# EAGLE design coil-driver-2 (EAGLE 4.16)
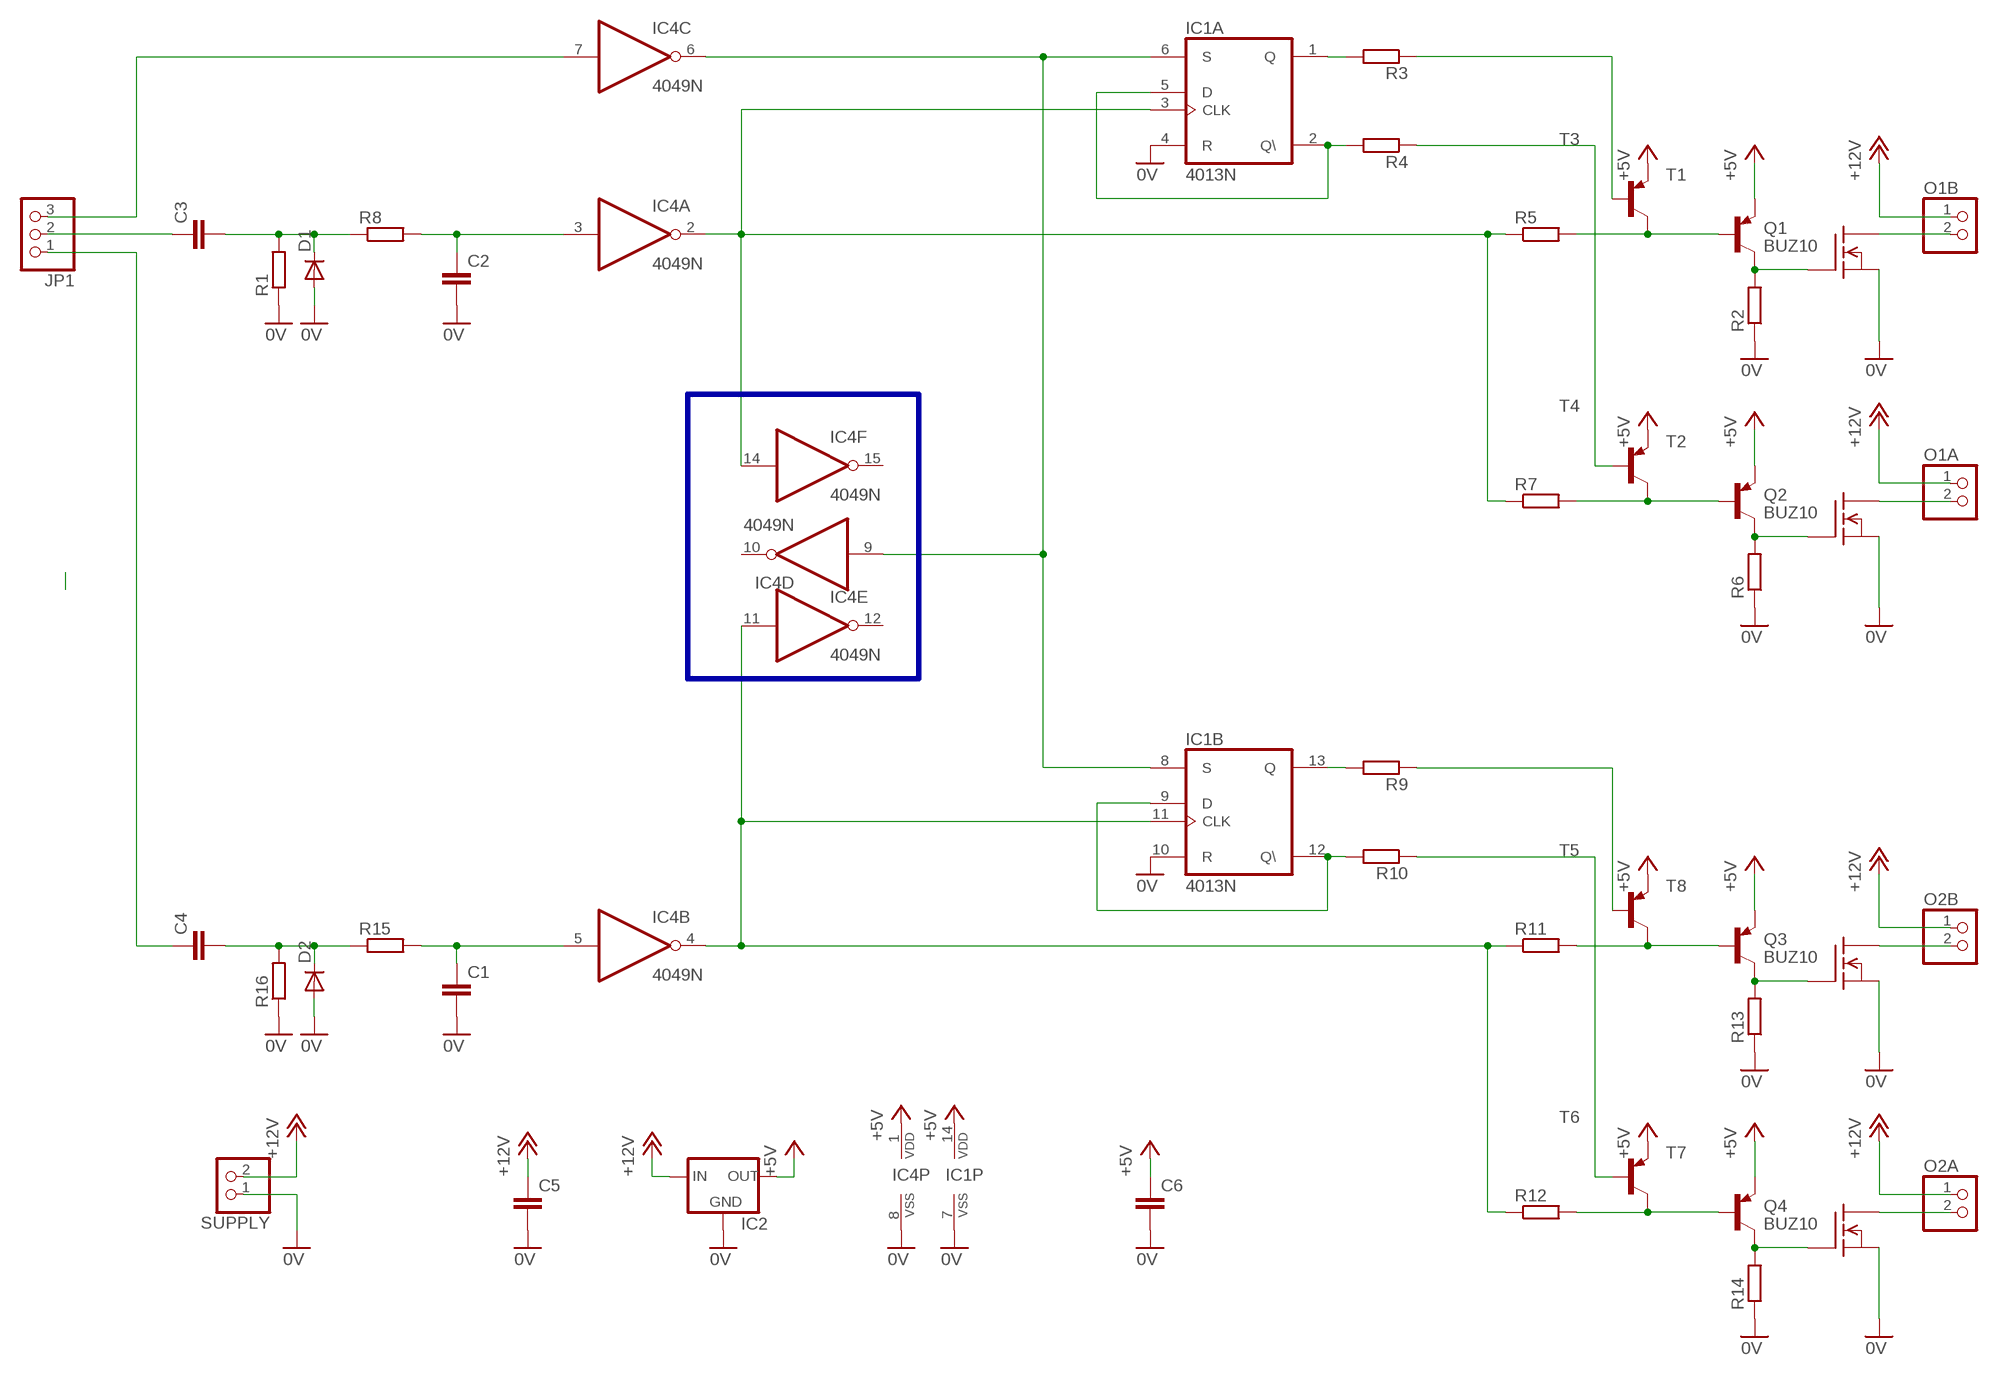
[diagram p0: schematic, sheet 1]

## Parts
C1  C-EU050-030X075  [C050-030X075]
C2  C-EU050-030X075  [C050-030X075]
C3  C-EU050-030X075  [C050-030X075]
C4  C-EU050-030X075  [C050-030X075]
C5  C-EU050-030X075  [C050-030X075]
C6  C-EU050-030X075  [C050-030X075]
D1  DIODE-D-7.5  [D-7.5]
D2  DIODE-D-7.5  [D-7.5]
IC1  4013N  [DIL14]
IC2  78XXL  [78XXL]
IC4  4049N  [DIL16]
JP1  PINHD-1X3  [1X03]
O1A  PINHD-1X2  [1X02]
O1B  PINHD-1X2  [1X02]
O2A  PINHD-1X2  [1X02]
O2B  PINHD-1X2  [1X02]
Q1  BUZ10  [TO220]
Q2  BUZ10  [TO220]
Q3  BUZ10  [TO220]
Q4  BUZ10  [TO220]
R1  R-EU_0207/7  [0207/7]
R2  R-EU_0207/7  [0207/7]
R3  R-EU_0207/7  [0207/7]
R4  R-EU_0207/7  [0207/7]
R5  R-EU_0207/7  [0207/7]
R6  R-EU_0207/7  [0207/7]
R7  R-EU_0207/7  [0207/7]
R8  R-EU_0207/7  [0207/7]
R9  R-EU_0207/7  [0207/7]
R10  R-EU_0207/7  [0207/7]
R11  R-EU_0207/7  [0207/7]
R12  R-EU_0207/7  [0207/7]
R13  R-EU_0207/7  [0207/7]
R14  R-EU_0207/7  [0207/7]
R15  R-EU_0207/7  [0207/7]
R16  R-EU_0207/7  [0207/7]
SUPPLY  PINHD-1X2  [1X02]
T1  BC557B-PNP-TO92-EBC  [TO92-EBC]
T2  BC557B-PNP-TO92-EBC  [TO92-EBC]
T3  BC557B-PNP-TO92-EBC  [TO92-EBC]
T4  BC557B-PNP-TO92-EBC  [TO92-EBC]
T5  BC557B-PNP-TO92-EBC  [TO92-EBC]
T6  BC557B-PNP-TO92-EBC  [TO92-EBC]
T7  BC557B-PNP-TO92-EBC  [TO92-EBC]
T8  BC557B-PNP-TO92-EBC  [TO92-EBC]

## Nets
0V: C1.2 C2.2 C5.2 C6.2 D1.A D2.A IC1.4(A:R) IC1.7(P:VSS) IC1.10(B:R) IC2.GND IC4.8(P:VSS) Q1.3(S) Q2.3(S) Q3.3(S) Q4.3(S) R1.1 R2.1 R6.1 R13.1 R14.1 R16.1 SUPPLY.1
+5V: C6.1 IC1.14(P:VDD) IC2.OUT IC4.1(P:VDD) T1.E T2.E T3.E T4.E T5.E T6.E T7.E T8.E
+12V: C5.1 IC2.IN O1A.1 O1B.1 O2A.1 O2B.1 SUPPLY.2
N$1: Q1.1(G) R2.2 T1.C
N$2: O1B.2 Q1.2(D)
N$3: IC1.1(A:Q) R3.2
N$4: IC1.2(A:Q\) IC1.5(A:D) R4.2
N$5: R3.1 T3.B
N$6: IC1.3(A:CLK) IC4.2(A:O) IC4.14(F:I) R5.1 R7.1
N$7: O1A.2 Q2.2(D)
N$8: C2.1 IC4.3(A:I) R8.2
N$9: Q2.1(G) R6.2 T2.C
N$10: R4.1 T4.B
N$11: R5.2 T1.B T3.C
N$12: IC1.11(B:CLK) IC4.4(B:O) IC4.11(E:I) R11.1 R12.1
N$13: IC1.13(B:Q) R9.2
N$14: R7.2 T2.B T4.C
N$15: C3.2 D1.C R1.2 R8.1
N$16: IC1.9(B:D) IC1.12(B:Q\) R10.2
N$17: R9.1 T5.B
N$18: R10.1 T6.B
N$19: Q3.1(G) R13.2 T8.C
N$20: R11.2 T5.C T8.B
N$21: R12.2 T6.C T7.B
N$22: Q4.1(G) R14.2 T7.C
N$23: O2A.2 Q4.2(D)
N$24: O2B.2 Q3.2(D)
N$25: C4.2 D2.C R15.1 R16.2
N$26: C1.1 IC4.5(B:I) R15.2
N$27: C4.1 JP1.1
N$28: C3.1 JP1.2
N$29: IC1.6(A:S) IC1.8(B:S) IC4.6(C:O) IC4.9(D:I)
N$32: IC4.7(C:I) JP1.3
Unconnected: IC4.10(D:O) IC4.12(E:O) IC4.15(F:O)

## Buses
B$1

## Library data of the parts
C1-C6 = rcl:C-EU: CAPACITOR, European symbol
D1 D2 = diode:DIODE-: DIODE
IC1 = 40xx:4013: Dual D FLIP FLOP, set/reset
IC2 = v-reg:78XXL: VOLTAGE REGULATOR
IC4 = 40xx:4049: Hex inverting BUFFER
JP1 = pinhead:PINHD-1X3: PIN HEADER
O1A O1B O2A O2B SUPPLY = pinhead:PINHD-1X2: PIN HEADER
Q1-Q4 = transistor-fet:BUZ10: N-Channel Enhancement MOSFET 50V; 20A; 0,080Ohm
R1-R16 = rcl:R-EU_: RESISTOR, European symbol
T1-T8 = transistor:*-PNP-: PNP Transistror

## Board
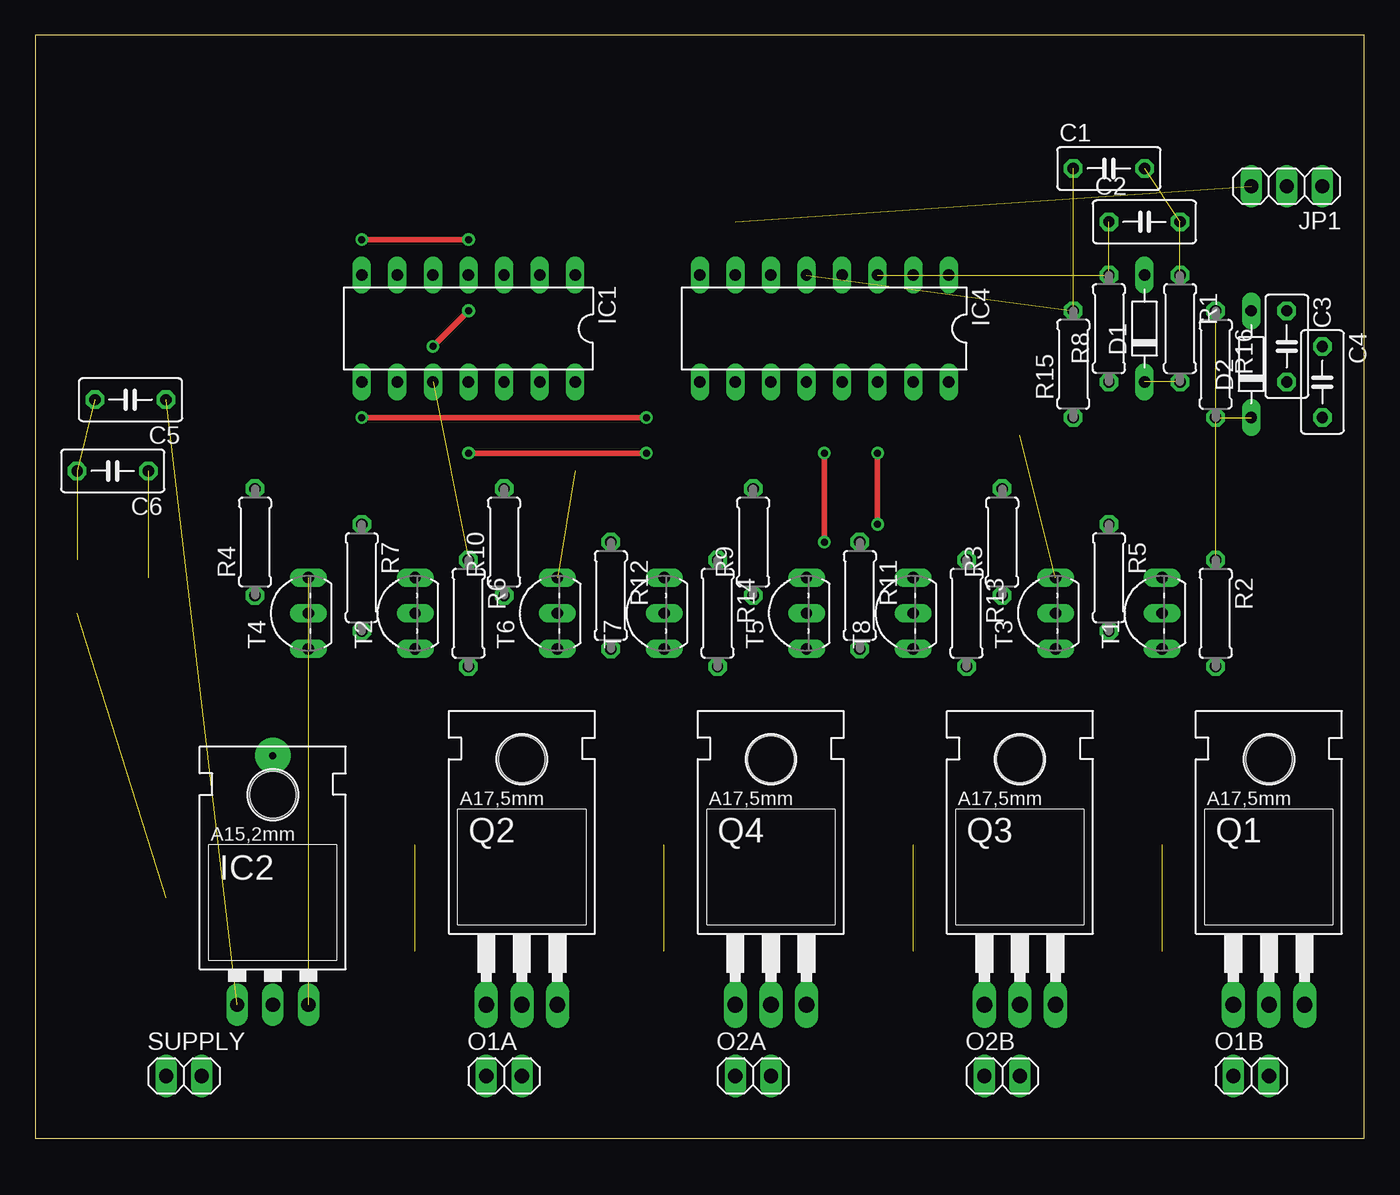
[diagram p1: board, top side]
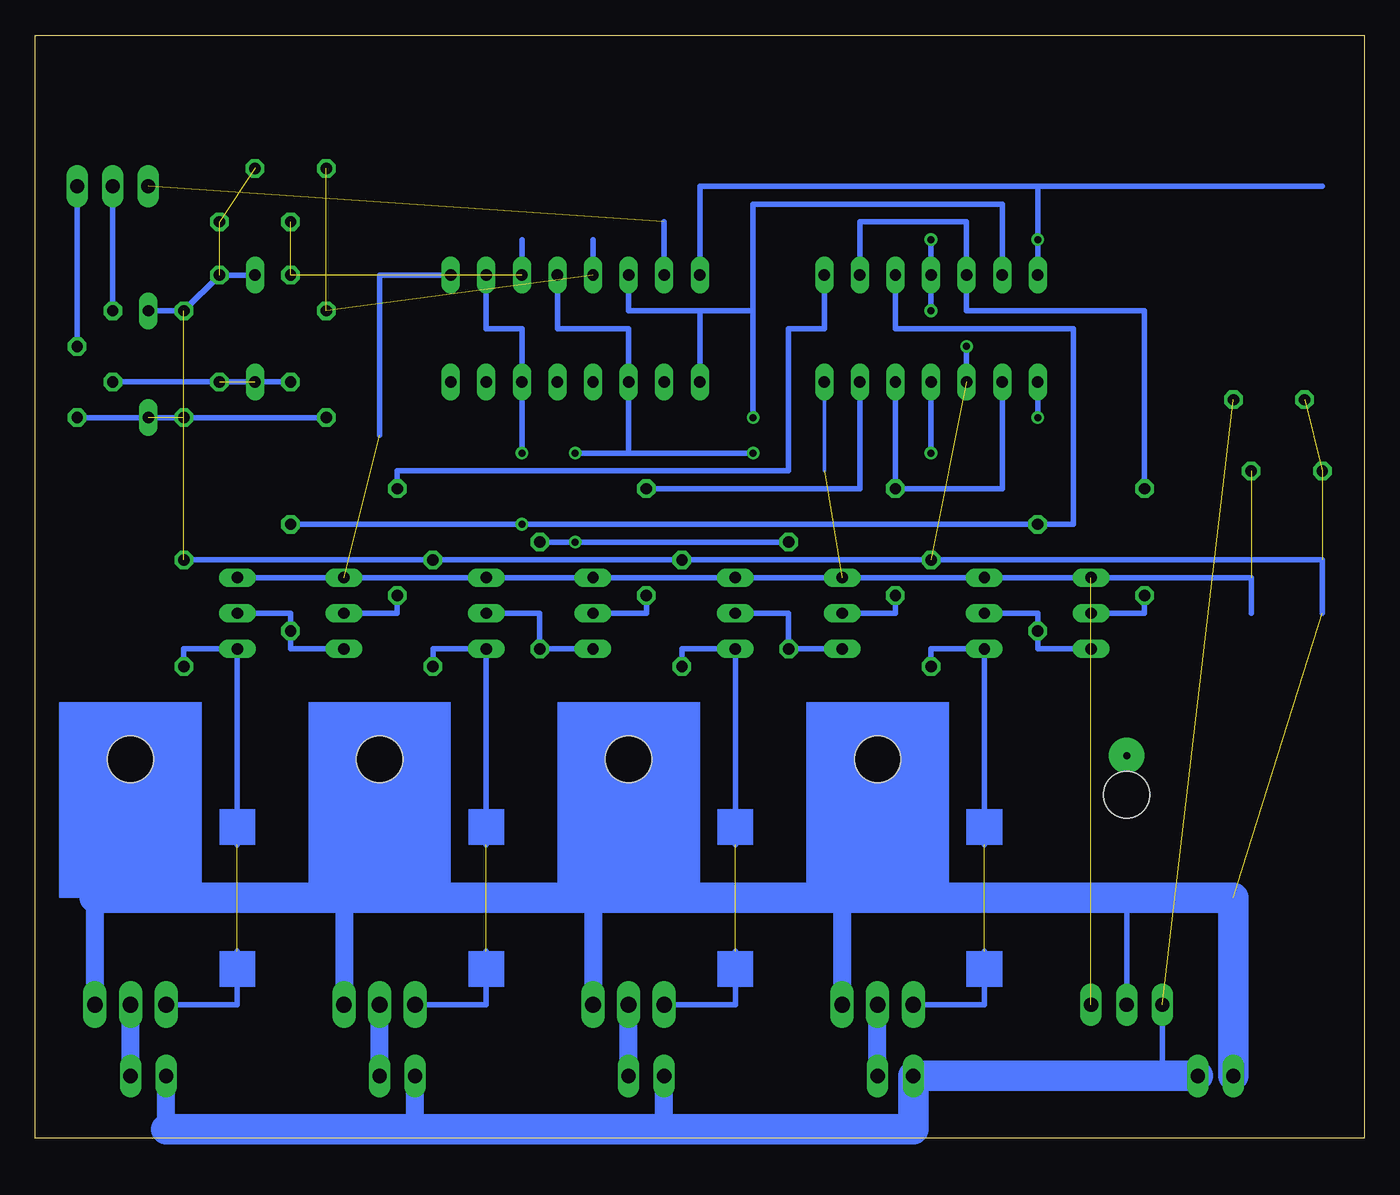
[diagram p2: board, bottom side, seen from below]

Size 94.92 x 78.73 mm. Coordinates in mm from the lower left corner, seen from the top.
Outline: 0,0 94.92,0 94.92,78.73 0,78.73 0,0
Copper layers (1*16): Top 0.035mm / dielectric 1.5mm / Bottom 0.035mm
Design rules "default": minimum track width 10mil, minimum drill 24mil, track to track 8mil, track to pad 8mil, pad to pad 8mil, via to via 8mil, smd to smd 8mil, copper to edge 40mil, drill to drill 8mil, minimum pad ring 10mil, minimum via ring 8mil, stop-mask expansion 4mil, vias tented up to drill 0mil, thermal gap 10mil

### Footprints (pad centres in the part's own frame; a part is rotated, then mirrored left to right if it is on the bottom)
C050-030X075 = drill 0.813 octagon: 1 -2.54,0; 2 2.54,0
D-7.5 = drill 0.813 long: A 3.81,0; C -3.81,0
DIL14 = drill 0.813 long: 1 -7.62,-3.81; 2 -5.08,-3.81; 3 -2.54,-3.81; 4 0,-3.81; 5 2.54,-3.81; 6 5.08,-3.81; 7 7.62,-3.81; 8 7.62,3.81; 9 5.08,3.81; 10 2.54,3.81; 11 0,3.81; 12 -2.54,3.81; 13 -5.08,3.81; 14 -7.62,3.81
78XXL = drill 1.016 long: GND 0,-3.81; IN -2.54,-3.81; OUT 2.54,-3.81 | hole 3.302: 0,11.176
DIL16 = drill 0.813 long: 1 -8.89,-3.81; 2 -6.35,-3.81; 3 -3.81,-3.81; 4 -1.27,-3.81; 5 1.27,-3.81; 6 3.81,-3.81; 7 6.35,-3.81; 8 8.89,-3.81; 9 8.89,3.81; 10 6.35,3.81; 11 3.81,3.81; 12 1.27,3.81; 13 -1.27,3.81; 14 -3.81,3.81; 15 -6.35,3.81; 16 -8.89,3.81
1X03 = drill 1.016 long: 1 -2.54,0; 2 0,0; 3 2.54,0
1X02 = drill 1.016 long: 1 -1.27,0; 2 1.27,0
TO220 = drill 1.118 long: 1 -2.54,-6.35; 2 0,-6.35; 3 2.54,-6.35 | hole 3.302: 0,11.176
0207/7 = drill 0.813 octagon: 1 -3.81,0; 2 3.81,0
TO92-EBC = drill 0.813 long: B 0,-1.27; C -2.54,-1.27; E 2.54,-1.27

### Placement (x,y rotation side)
C1  76.67,69.21 0 top
C2  79.21,65.4 0 top
C3  89.37,56.51 270 top
C4  91.91,53.97 270 top
C5  6.82,52.7 180 top
C6  5.55,47.62 180 top
D1  79.21,57.78 90 top
D2  86.83,55.24 90 top
IC1  30.95,57.78 180 top
IC2  16.98,13.33 0 top
IC4  56.35,57.78 180 top
JP1  89.37,67.94 180 top
O1A  33.49,4.44 0 top
O1B  86.83,4.44 0 top
O2A  51.27,4.44 0 top
O2B  69.05,4.44 0 top
Q1  88.1,15.87 0 top
Q2  34.76,15.87 0 top
Q3  70.32,15.87 0 top
Q4  52.54,15.87 0 top
R1  81.75,57.78 270 top
R2  84.29,37.46 270 top
R3  69.05,42.54 90 top
R4  15.71,42.54 90 top
R5  76.67,40 270 top
R6  30.95,37.46 270 top
R7  23.33,40 270 top
R8  76.67,57.78 90 top
R9  51.27,42.54 90 top
R10  33.49,42.54 90 top
R11  58.89,38.73 270 top
R12  41.11,38.73 270 top
R13  66.51,37.46 270 top
R14  48.73,37.46 270 top
R15  74.13,55.24 90 top
R16  84.29,55.24 270 top
SUPPLY  10.63,4.44 0 top
T1  79.21,37.46 90 top
T2  25.87,37.46 90 top
T3  71.59,37.46 90 top
T4  18.25,37.46 90 top
T5  53.81,37.46 90 top
T6  36.03,37.46 90 top
T7  43.65,37.46 90 top
T8  61.43,37.46 90 top

### Tracks (layer width: path | path; a pad name or v marks a point on that pad's centre or on a via)
0V  (via drill 0.5)  (7 unrouted)
  Top 0.406: v23.33,64.13 v30.95,64.13 | v30.95,59.05 v28.41,56.51
  Bottom 0.406: R2.1 R13.1 R14.1 R6.1 3.01,41.27 3.01,37.46 | 16.98,17.14 IC2.GND | 23.33,67.94 v23.33,64.13 IC1.7 | D1.A R1.1 R16.1 D2.A | 3.01,67.94 23.33,67.94 | IC4.8 47.46,67.94 23.33,67.94 | v30.95,64.13 IC1.4 v30.95,59.05 | v28.41,56.51 IC1.10
  Bottom 1.27: 90.64,17.14 Q1.3 | 37.3,17.14 Q2.3 | 55.08,17.14 Q4.3 | 72.86,17.14 Q3.3
  Bottom 2.184: SUPPLY.1 9.36,17.14 16.98,17.14 37.3,17.14 55.08,17.14 72.86,17.14 90.64,17.14
+5V  (4 unrouted)
  Bottom 0.254: 38.57,47.62 IC1.14
  Bottom 0.406: T1.E T3.E T8.E T5.E T7.E T6.E T2.E T4.E 8.09,40 8.09,37.46 | IC4.1 70.32,61.59 70.32,50.16
+12V  (1 unrouted)
  Bottom 0.406: O1A.1 14.44,4.44 IC2.IN
  Bottom 1.27: 50,0.63 O2A.1 | 67.78,0.63 O2B.1 | 85.56,0.63 O1B.1
  Bottom 2.184: SUPPLY.2 O1A.1 32.22,0.63 50,0.63 67.78,0.63 85.56,0.63
N$1  (1 unrouted)
  Bottom 0.406: 80.48,20.95 T1.C 84.29,34.92 R2.2 | Q1.1 80.48,9.52 80.48,13.33
N$2
  Bottom 1.27: O1B.2 Q1.2
N$3
  Bottom 0.406: R3.2 69.05,47.62 41.11,47.62 41.11,57.78 38.57,57.78 IC1.1
N$4
  Bottom 0.406: R4.2 15.71,59.05 28.41,59.05 IC1.5 28.41,65.4 36.03,65.4 IC1.2
N$5
  Bottom 0.406: T3.B 69.05,37.46 R3.1
N$6  (via drill 0.5)
  Top 0.406: v60.16,43.81 v60.16,48.89
  Bottom 0.406: R5.1 v60.16,43.81 R7.1 20.79,43.81 20.79,57.78 33.49,57.78 IC1.3 | IC4.2 62.7,57.78 60.16,57.78 IC4.14 v60.16,48.89
N$7
  Bottom 1.27: O1A.2 Q2.2
N$8  (2 unrouted)
  Bottom 0.406: IC4.3 60.16,64.13
N$9  (1 unrouted)
  Bottom 0.406: 27.14,20.95 T2.C 30.95,34.92 R6.2 | Q2.1 27.14,9.52 27.14,13.33
N$10
  Bottom 0.406: T4.B 15.71,37.46 R4.1
N$11
  Bottom 0.406: T3.C 76.67,34.92 R5.2 76.67,37.46 T1.B
N$12  (via drill 0.5)
  Top 0.406: v56.35,48.89 v56.35,42.54 | v30.95,48.89 v43.65,48.89
  Bottom 0.406: R12.1 v56.35,42.54 R11.1 | IC4.4 57.62,57.78 52.54,57.78 IC4.11 52.54,48.89 | 52.54,48.89 v56.35,48.89 | v30.95,48.89 IC1.11 | v43.65,48.89 52.54,48.89
N$13
  Bottom 0.406: R9.2 36.03,46.35 IC1.13
N$14
  Bottom 0.406: T4.C 23.33,34.92 R7.2 23.33,37.46 T2.B
N$15  (1 unrouted)
  Bottom 0.406: C3.2 R1.2 R8.1
N$16
  Bottom 0.406: IC1.9 25.87,46.35 R10.2 IC1.12
N$17
  Bottom 0.406: T5.B 51.27,37.46 R9.1
N$18
  Bottom 0.406: R10.1 33.49,37.46 T6.B
N$19  (1 unrouted)
  Bottom 0.406: 62.7,20.95 T8.C 66.51,34.92 R13.2 | Q3.1 62.7,9.52 62.7,13.33
N$20
  Bottom 0.406: T5.C R11.2 58.89,37.46 T8.B
N$21
  Bottom 0.406: T6.C R12.2 41.11,37.46 T7.B
N$22  (1 unrouted)
  Bottom 0.406: 44.92,20.95 T7.C 48.73,34.92 R14.2 | Q4.1 44.92,9.52 44.92,13.33
N$23
  Bottom 1.27: O2A.2 Q4.2
N$24
  Bottom 1.27: O2B.2 Q3.2
N$25  (1 unrouted)
  Bottom 0.406: C4.2 R16.2 R15.1
N$26  (2 unrouted)
  Bottom 0.406: IC4.5 55.08,64.13
N$27
  Bottom 0.406: C4.1 JP1.1
N$28
  Bottom 0.406: C3.1 JP1.2
N$29  (via drill 0.5)
  Top 0.406: v23.33,51.43 v43.65,51.43
  Bottom 0.406: IC4.6 52.54,59.05 47.46,59.05 | 43.65,59.05 47.46,59.05 | 43.65,59.05 43.65,66.67 25.87,66.67 IC1.6 | v43.65,51.43 43.65,59.05 | v23.33,51.43 IC1.8 | 47.46,59.05 IC4.9
N$31  (via drill 0.5 pad 2.54)
  other vias: 34.76,27.3
N$32  (1 unrouted)
  Bottom 0.406: IC4.7 50,65.4
N$33  (via drill 0.5 pad 2.54)
  other vias: 52.54,27.3
N$34  (via drill 0.5 pad 2.54)
  other vias: 70.32,27.3
N$35  (via drill 0.5 pad 2.54)
  other vias: 88.1,27.3
N$36  (via drill 0.5 pad 2.54)
  other vias: 16.98,27.3
(copper drawn outside any net)
  shapes: Bottom area x12